# EAGLE design line-board (EAGLE 9.5.0)
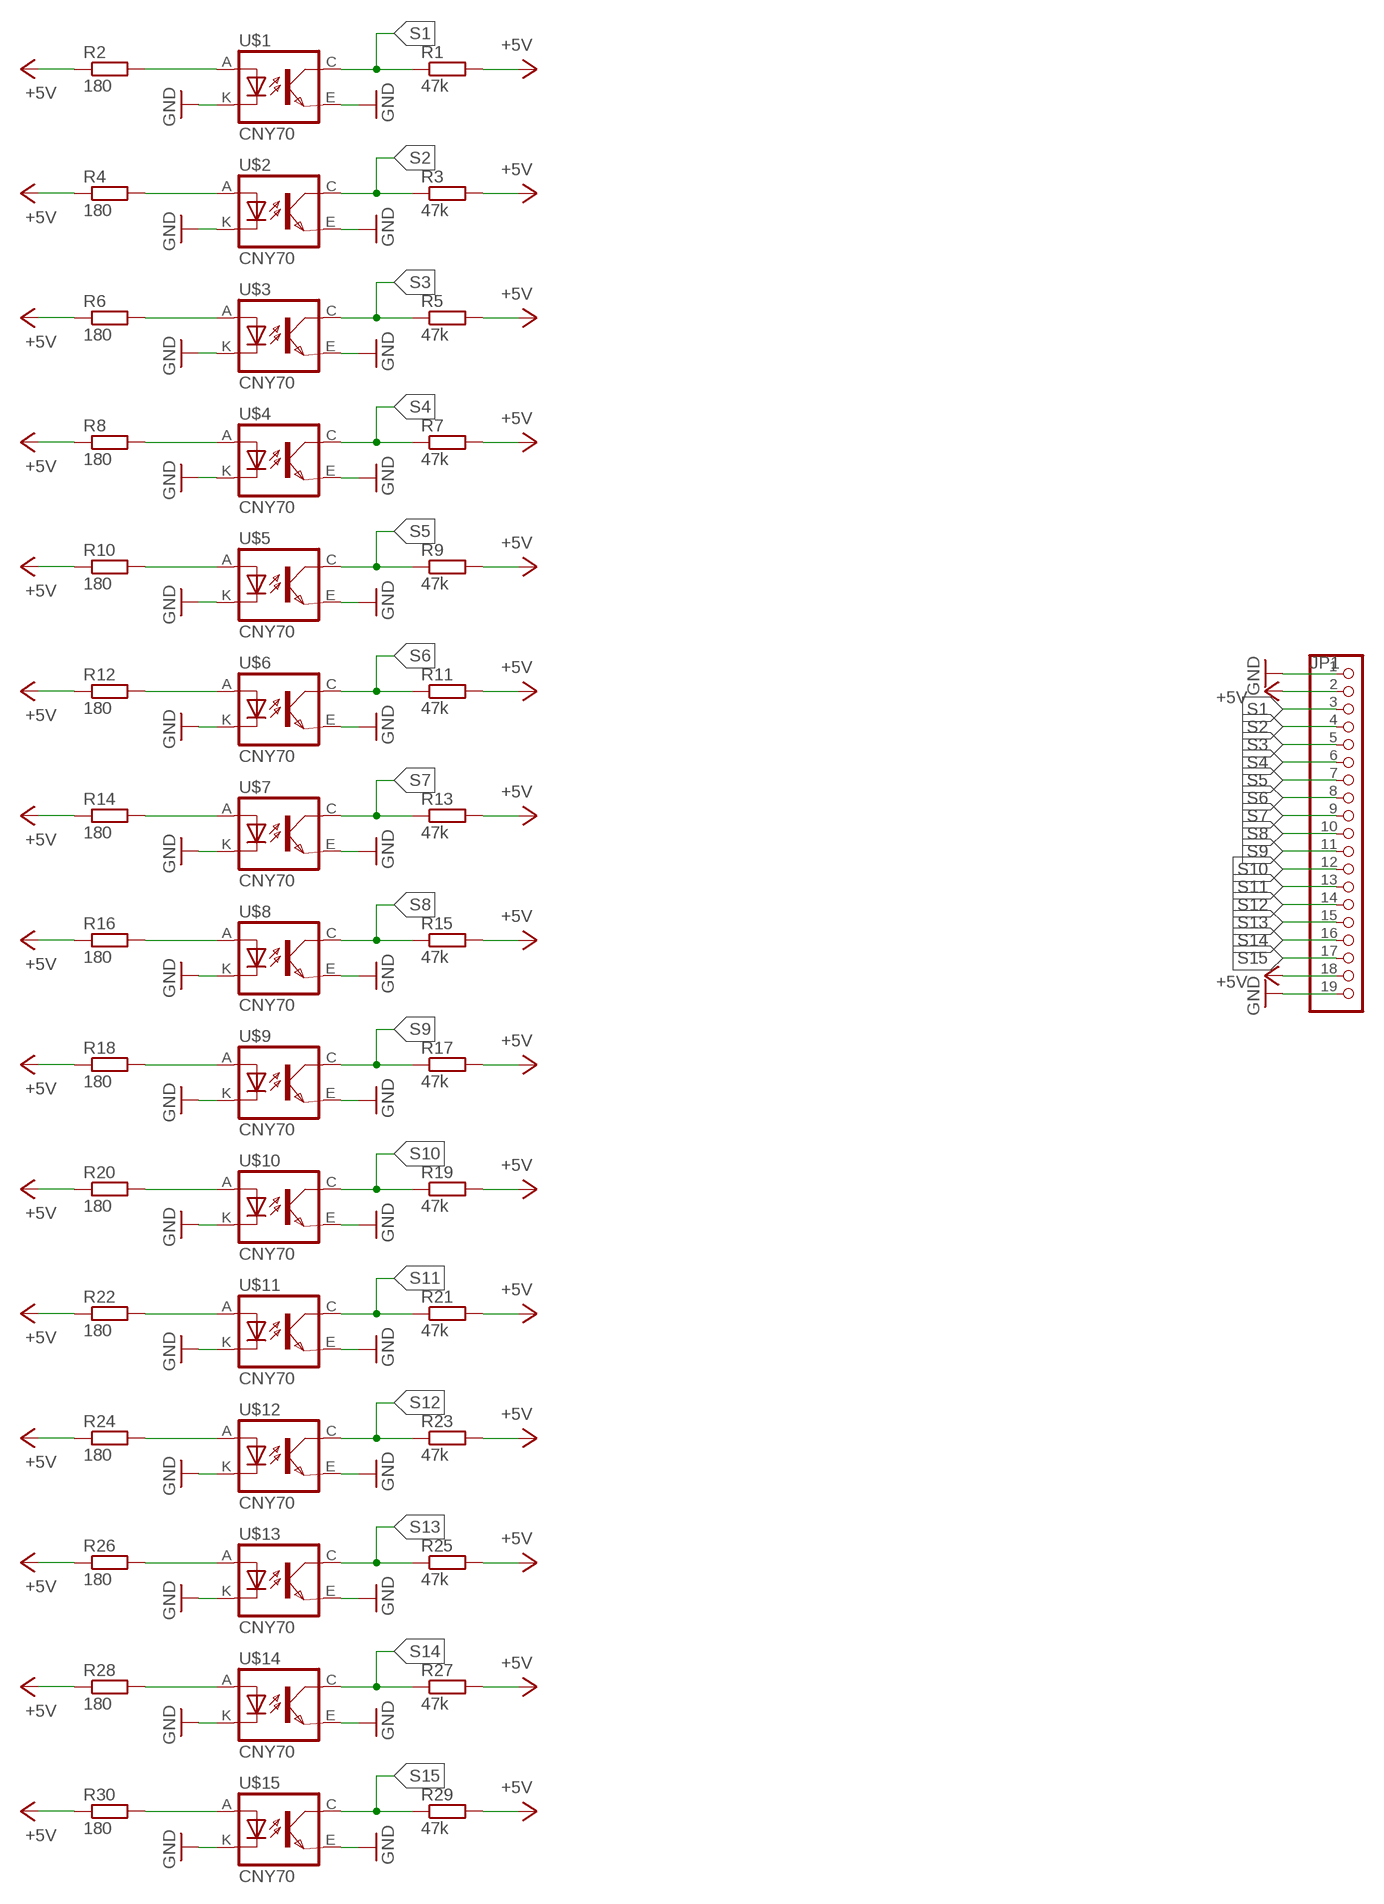
[diagram p0: schematic, sheet 1]

## Parts
JP1  PINHD-1X19  [1X19]
R1  47k  R-EU_R1206  [R1206]
R2  180  R-EU_R1206  [R1206]
R3  47k  R-EU_R1206  [R1206]
R4  180  R-EU_R1206  [R1206]
R5  47k  R-EU_R1206  [R1206]
R6  180  R-EU_R1206  [R1206]
R7  47k  R-EU_R1206  [R1206]
R8  180  R-EU_R1206  [R1206]
R9  47k  R-EU_R1206  [R1206]
R10  180  R-EU_R1206  [R1206]
R11  47k  R-EU_R1206  [R1206]
R12  180  R-EU_R1206  [R1206]
R13  47k  R-EU_R1206  [R1206]
R14  180  R-EU_R1206  [R1206]
R15  47k  R-EU_R1206  [R1206]
R16  180  R-EU_R1206  [R1206]
R17  47k  R-EU_R1206  [R1206]
R18  180  R-EU_R1206  [R1206]
R19  47k  R-EU_R1206  [R1206]
R20  180  R-EU_R1206  [R1206]
R21  47k  R-EU_R1206  [R1206]
R22  180  R-EU_R1206  [R1206]
R23  47k  R-EU_R1206  [R1206]
R24  180  R-EU_R1206  [R1206]
R25  47k  R-EU_R1206  [R1206]
R26  180  R-EU_R1206  [R1206]
R27  47k  R-EU_R1206  [R1206]
R28  180  R-EU_R1206  [R1206]
R29  47k  R-EU_R1206  [R1206]
R30  180  R-EU_R1206  [R1206]
U$1  CNY70  [4]
U$2  CNY70  [4]
U$3  CNY70  [4]
U$4  CNY70  [4]
U$5  CNY70  [4]
U$6  CNY70  [4]
U$7  CNY70  [4]
U$8  CNY70  [4]
U$9  CNY70  [4]
U$10  CNY70  [4]
U$11  CNY70  [4]
U$12  CNY70  [4]
U$13  CNY70  [4]
U$14  CNY70  [4]
U$15  CNY70  [4]

## Nets
+5V: JP1.2 JP1.18 R1.2 R2.1 R3.2 R4.1 R5.2 R6.1 R7.2 R8.1 R9.2 R10.1 R11.2 R12.1 R13.2 R14.1 R15.2 R16.1 R17.2 R18.1 R19.2 R20.1 R21.2 R22.1 R23.2 R24.1 R25.2 R26.1 R27.2 R28.1 R29.2 R30.1
GND: JP1.1 JP1.19 U$1.E(EMI) U$1.K(C) U$2.E(EMI) U$2.K(C) U$3.E(EMI) U$3.K(C) U$4.E(EMI) U$4.K(C) U$5.E(EMI) U$5.K(C) U$6.E(EMI) U$6.K(C) U$7.E(EMI) U$7.K(C) U$8.E(EMI) U$8.K(C) U$9.E(EMI) U$9.K(C) U$10.E(EMI) U$10.K(C) U$11.E(EMI) U$11.K(C) U$12.E(EMI) U$12.K(C) U$13.E(EMI) U$13.K(C) U$14.E(EMI) U$14.K(C) U$15.E(EMI) U$15.K(C)
N$1: R24.2 U$12.A
N$2: R2.2 U$1.A
N$3: R4.2 U$2.A
N$4: R26.2 U$13.A
N$5: R6.2 U$3.A
N$6: R28.2 U$14.A
N$7: R8.2 U$4.A
N$8: R30.2 U$15.A
N$9: R10.2 U$5.A
N$11: R12.2 U$6.A
N$13: R14.2 U$7.A
N$15: R16.2 U$8.A
N$17: R18.2 U$9.A
N$19: R20.2 U$10.A
N$21: R22.2 U$11.A
S1: JP1.3 R1.1 U$1.C(COL)
S2: JP1.4 R3.1 U$2.C(COL)
S3: JP1.5 R5.1 U$3.C(COL)
S4: JP1.6 R7.1 U$4.C(COL)
S5: JP1.7 R9.1 U$5.C(COL)
S6: JP1.8 R11.1 U$6.C(COL)
S7: JP1.9 R13.1 U$7.C(COL)
S8: JP1.10 R15.1 U$8.C(COL)
S9: JP1.11 R17.1 U$9.C(COL)
S10: JP1.12 R19.1 U$10.C(COL)
S11: JP1.13 R21.1 U$11.C(COL)
S12: JP1.14 R23.1 U$12.C(COL)
S13: JP1.15 R25.1 U$13.C(COL)
S14: JP1.16 R27.1 U$14.C(COL)
S15: JP1.17 R29.1 U$15.C(COL)

## Library data of the parts
JP1 = pinhead:PINHD-1X19: PIN HEADER
R1-R30 = rcl:R-EU_: RESISTOR, European symbol; SPICEPREFIX: R
U$1-U$15 = cny70:CNY70

## Board
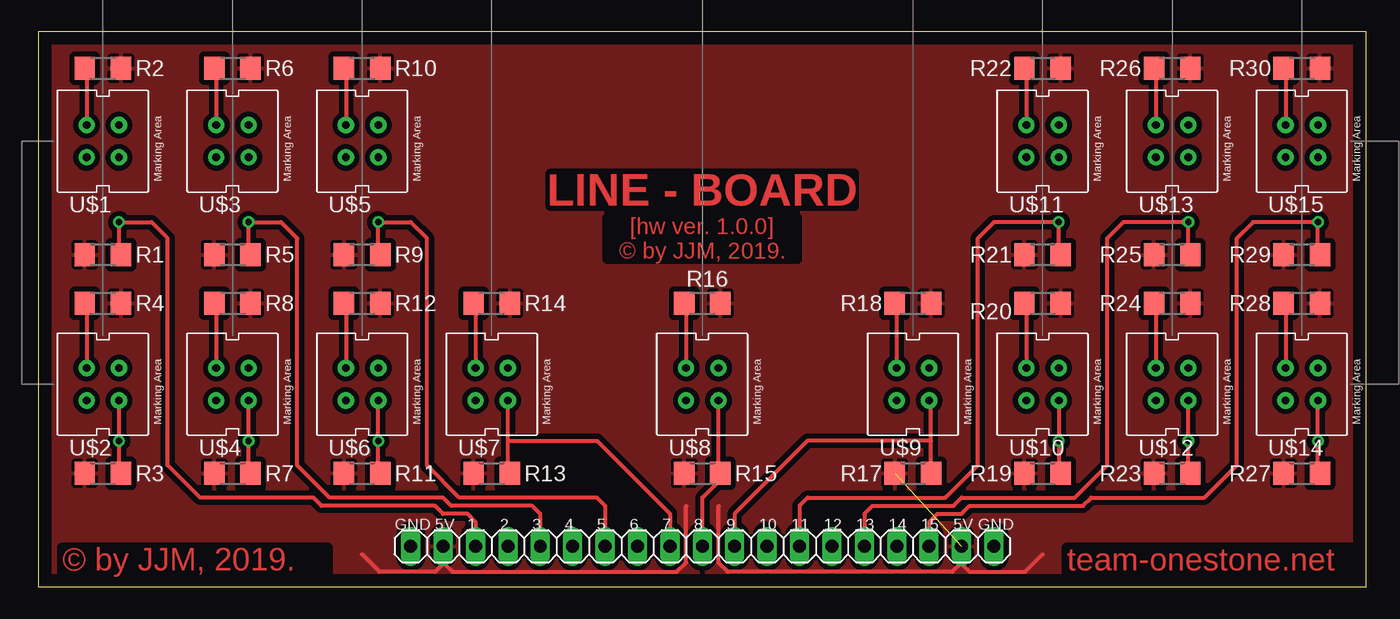
[diagram p1: board, top side]
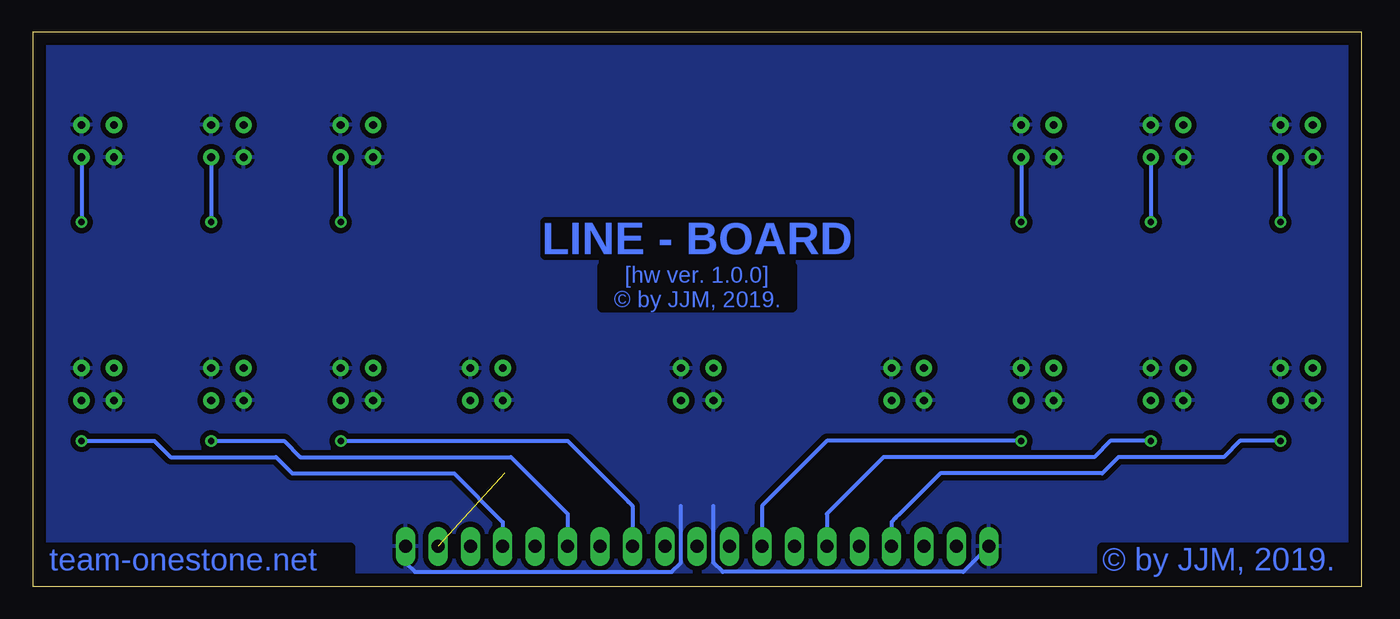
[diagram p2: board, bottom side, seen from below]

Size 104.12 x 43.48 mm. Coordinates in mm from the lower left corner, seen from the top.
Outline: 0,0 104.12,0 104.12,43.48 0,43.48 0,0
Copper layers (1*16): Top 0.035mm / dielectric 1.5mm / Bottom 0.035mm
Design rules "default": minimum track width 6mil, minimum drill 0.35mm, track to track 6mil, track to pad 6mil, pad to pad 6mil, via to via 6mil, smd to smd 6mil, copper to edge 40mil, drill to drill 6mil, minimum pad ring 10mil, minimum via ring 8mil, stop-mask expansion 4mil, vias tented up to drill 0mil, thermal gap 10mil

### Footprints (pad centres in the part's own frame; a part is rotated, then mirrored left to right if it is on the bottom)
1X19 = drill 1.016 long: 1 -22.86,0; 2 -20.32,0; 3 -17.78,0; 4 -15.24,0; 5 -12.7,0; 6 -10.16,0; 7 -7.62,0; 8 -5.08,0; 9 -2.54,0; 10 0,0; 11 2.54,0; 12 5.08,0; 13 7.62,0; 14 10.16,0; 15 12.7,0; 16 15.24,0; 17 17.78,0; 18 20.32,0; 19 22.86,0
R1206 = smd 1.6 x 1.803: 1 -1.422,0; 2 1.422,0
4 = drill 0.61 pad 1.27: A -1.27,1.27; C 1.27,-1.27; E 1.27,1.27; K -1.27,-1.27

### Placement (x,y rotation side)
JP1  52.07,3.17 0 top
R1  5.08,26.04 180 top
R2  5.08,40.64 180 top
R3  5.08,8.89 180 top
R4  5.08,22.23 180 top
R5  15.24,26.04 180 top
R6  15.24,40.64 180 top
R7  15.24,8.89 180 top
R8  15.24,22.23 180 top
R9  25.4,26.04 180 top
R10  25.4,40.64 180 top
R11  25.4,8.89 180 top
R12  25.4,22.23 180 top
R13  35.56,8.89 180 top
R14  35.56,22.23 180 top
R15  52.07,8.89 180 top
R16  52.07,22.23 180 top
R17  68.58,8.89 180 top
R18  68.58,22.23 180 top
R19  78.74,8.89 180 top
R20  78.74,22.23 180 top
R21  78.74,26.04 180 top
R22  78.74,40.64 180 top
R23  88.9,8.89 180 top
R24  88.9,22.23 180 top
R25  88.9,26.04 180 top
R26  88.9,40.64 180 top
R27  99.06,8.89 180 top
R28  99.06,22.23 180 top
R29  99.06,26.04 180 top
R30  99.06,40.64 180 top
U$1  5.08,34.92 0 top
U$2  5.08,15.88 0 top
U$3  15.24,34.92 0 top
U$4  15.24,15.88 0 top
U$5  25.4,34.92 0 top
U$6  25.4,15.88 0 top
U$7  35.56,15.88 0 top
U$8  52.07,15.88 0 top
U$9  68.58,15.88 0 top
U$10  78.74,15.88 0 top
U$11  78.74,34.92 0 top
U$12  88.9,15.88 0 top
U$13  88.9,34.92 0 top
U$14  99.06,15.88 0 top
U$15  99.06,34.92 0 top

### Tracks (layer width: path | path; a pad name or v marks a point on that pad's centre or on a via)
+5V  (1 unrouted)
  Top 0.305: 50.8,6.35 50.8,1.91 50.06,1.17 32.49,1.17 31.75,1.91 JP1.2 31.75,1.8 31.11,1.17 26.77,1.17 25.4,2.54 | 53.34,6.35 53.34,1.91 54.08,1.17 71.65,1.17 72.39,1.91 JP1.18 72.39,1.8 73.03,1.17 77.37,1.17 78.74,2.54
  pour Top (isolate 0.406): 0,43.18 0,0 104.14,0 104.14,43.18
GND
  Bottom 0.305: 29.21,1.91 JP1.1 31.22,1.17 50.06,1.17 50.8,1.91 50.8,6.35 | JP1.19 74.93,1.91 74.19,1.17 54.08,1.17 53.34,1.91 53.34,6.35
  pour Bottom (isolate 0.406): 0,0 104.14,0 104.14,43.18 0,43.18
N$1
  Top 0.305: R24.2 87.63,22.07 U$12.A
N$2
  Top 0.305: R2.2 3.81,40.49 U$1.A
N$3
  Top 0.305: R4.2 3.81,22.07 U$2.A
N$4
  Top 0.305: R26.2 87.63,40.49 U$13.A
N$5
  Top 0.305: R6.2 13.97,40.49 U$3.A
N$6
  Top 0.305: R28.2 97.79,22.07 U$14.A
N$7
  Top 0.305: R8.2 13.97,22.07 U$4.A
N$8
  Top 0.305: R30.2 97.79,40.49 U$15.A
N$9
  Top 0.305: R10.2 24.13,40.49 U$5.A
N$11
  Top 0.305: R12.2 24.13,22.07 U$6.A
N$13
  Top 0.305: R14.2 34.29,22.07 U$7.A
N$15
  Top 0.305: R16.2 50.8,22.07 U$8.A
N$17
  Top 0.305: R18.2 67.31,22.07 U$9.A
N$19
  Top 0.305: R20.2 77.47,22.07 U$10.A
N$21
  Top 0.305: R22.2 77.47,40.49 U$11.A
S1  (via drill 0.5)
  Top 0.305: R1.1 6.35,26.19 v6.35,28.57 8.89,28.57 10.16,27.3 10.16,9.53 12.7,6.99 21.59,6.99 22.23,6.35 31.11,6.35 31.75,5.71 33.66,5.71 34.29,5.08 JP1.3
  Bottom 0.305: U$1.C v6.35,28.57
S2  (via drill 0.5)
  Top 0.305: R3.1 6.35,9.04 v6.35,11.43 U$2.C
  Bottom 0.305: JP1.4 36.83,5.08 36.51,5.4 36.2,5.71 33.02,8.89 20.32,8.89 19.05,10.16 10.79,10.16 9.53,11.43 v6.35,11.43
S3  (via drill 0.5)
  Top 0.305: R5.1 16.51,26.19 v16.51,28.57 19.05,28.57 20.32,27.3 20.32,9.53 22.86,6.99 31.75,6.99 32.38,6.35 38.73,6.35 39.37,5.71 JP1.5
  Bottom 0.305: U$3.C v16.51,28.57
S4  (via drill 0.5)
  Top 0.305: R7.1 16.51,9.04 v16.51,11.43 U$4.C
  Bottom 0.305: JP1.6 41.91,5.71 37.47,10.16 20.95,10.16 19.68,11.43 v16.51,11.43
S5  (via drill 0.5)
  Top 0.305: R9.1 26.67,26.19 v26.67,28.57 29.21,28.57 30.48,27.3 30.48,9.53 33.02,6.99 43.81,6.99 44.45,6.35 JP1.7
  Bottom 0.305: U$5.C v26.67,28.57
S6  (via drill 0.5)
  Top 0.305: R11.1 26.67,9.04 v26.67,11.43 U$6.C
  Bottom 0.305: JP1.8 46.99,6.35 46.35,6.99 41.91,11.43 v26.67,11.43
S7
  Top 0.305: R13.1 36.83,9.04 36.83,11.43 | 36.83,11.43 U$7.C | 36.83,11.43 43.81,11.43 49.53,5.71 JP1.9
S8
  Top 0.305: U$8.C 53.34,9.04 R15.1 53.49,8.41 52.07,6.99 JP1.10
S9
  Top 0.305: 69.85,9.04 R17.1 70,11.43 | 70,11.43 70,14.45 U$9.C | JP1.11 54.61,5.71 60.33,11.43 70,11.43
S10  (via drill 0.5)
  Top 0.305: R19.1 80.01,9.04 v80.01,11.43 U$10.C
  Bottom 0.305: JP1.12 57.15,6.35 57.47,6.67 57.78,6.99 62.23,11.43 v80.01,11.43
S11  (via drill 0.5)
  Top 0.305: R21.1 80.01,26.19 v80.01,28.57 74.93,28.57 73.66,27.3 73.66,9.53 71.12,6.99 60.33,6.99 59.69,6.35 JP1.13
  Bottom 0.305: U$11.C v80.01,28.57
S12  (via drill 0.5)
  Top 0.305: R23.1 90.17,9.04 v90.17,11.43 U$12.C
  Bottom 0.305: JP1.14 62.23,5.71 66.67,10.16 83.19,10.16 84.45,11.43 v90.17,11.43
S13  (via drill 0.5)
  Top 0.305: R25.1 90.17,26.19 v90.17,28.57 85.09,28.57 83.82,27.3 83.82,9.53 81.28,6.99 72.39,6.99 71.75,6.35 65.41,6.35 64.77,5.71 JP1.15
  Bottom 0.305: U$13.C v90.17,28.57
S14  (via drill 0.5)
  Top 0.305: R27.1 100.33,9.04 v100.33,11.43 U$14.C
  Bottom 0.305: JP1.16 67.31,5.08 71.12,8.89 83.82,8.89 85.09,10.16 93.34,10.16 94.61,11.43 v100.33,11.43
S15  (via drill 0.5)
  Top 0.305: R29.1 100.33,26.19 v100.33,28.57 95.25,28.57 93.98,27.3 93.98,9.53 91.44,6.99 82.55,6.99 81.92,6.35 73.03,6.35 72.39,5.71 70.48,5.71 69.85,5.08 JP1.17
  Bottom 0.305: U$15.C v100.33,28.57

### Text on the board
Top: LINE - BOARD | [hw ver. 1.0.0] / © by JJM, 2019. | © by JJM, 2019. | team-onestone.net
Bottom: LINE - BOARD | [hw ver. 1.0.0] / © by JJM, 2019. | © by JJM, 2019. | team-onestone.net
tPlace: GND | 5V | 1 | 2 | 3 | 4 | 5 | 6 | 7 | 8 | 9 | 10 | 11 | 12 | 13 | 14 | 15 | 5V | GND